# Altium project MB1829.PrjPcb (part 4 of 5)

## Sheet ST_LINK_V3E.SchDoc: ST_LINK_V3E
size A3; Date: Not used; ApprovedBy: Not used; CheckedBy: Not used; Author: Not used; CompanyName: STMicroelectronics; DrawnBy: Not used; Engineer: Not used; Organization: Not used; Address1: Not used; Address2: Not used; Address3: Not used; Address4: Not used; DocumentNumber: Not used; Revision: Not used; SheetNumber: 15; SheetTotal: 16; CurrentTime: Not used; CurrentDate: Not used; Time: Not used; DocumentFullPathAndName: Not used; DocumentName: Not used; ModifiedDate: Not used; ImagePath: Not used; ProjectName: Not used; Application_BuildNumber: Not used
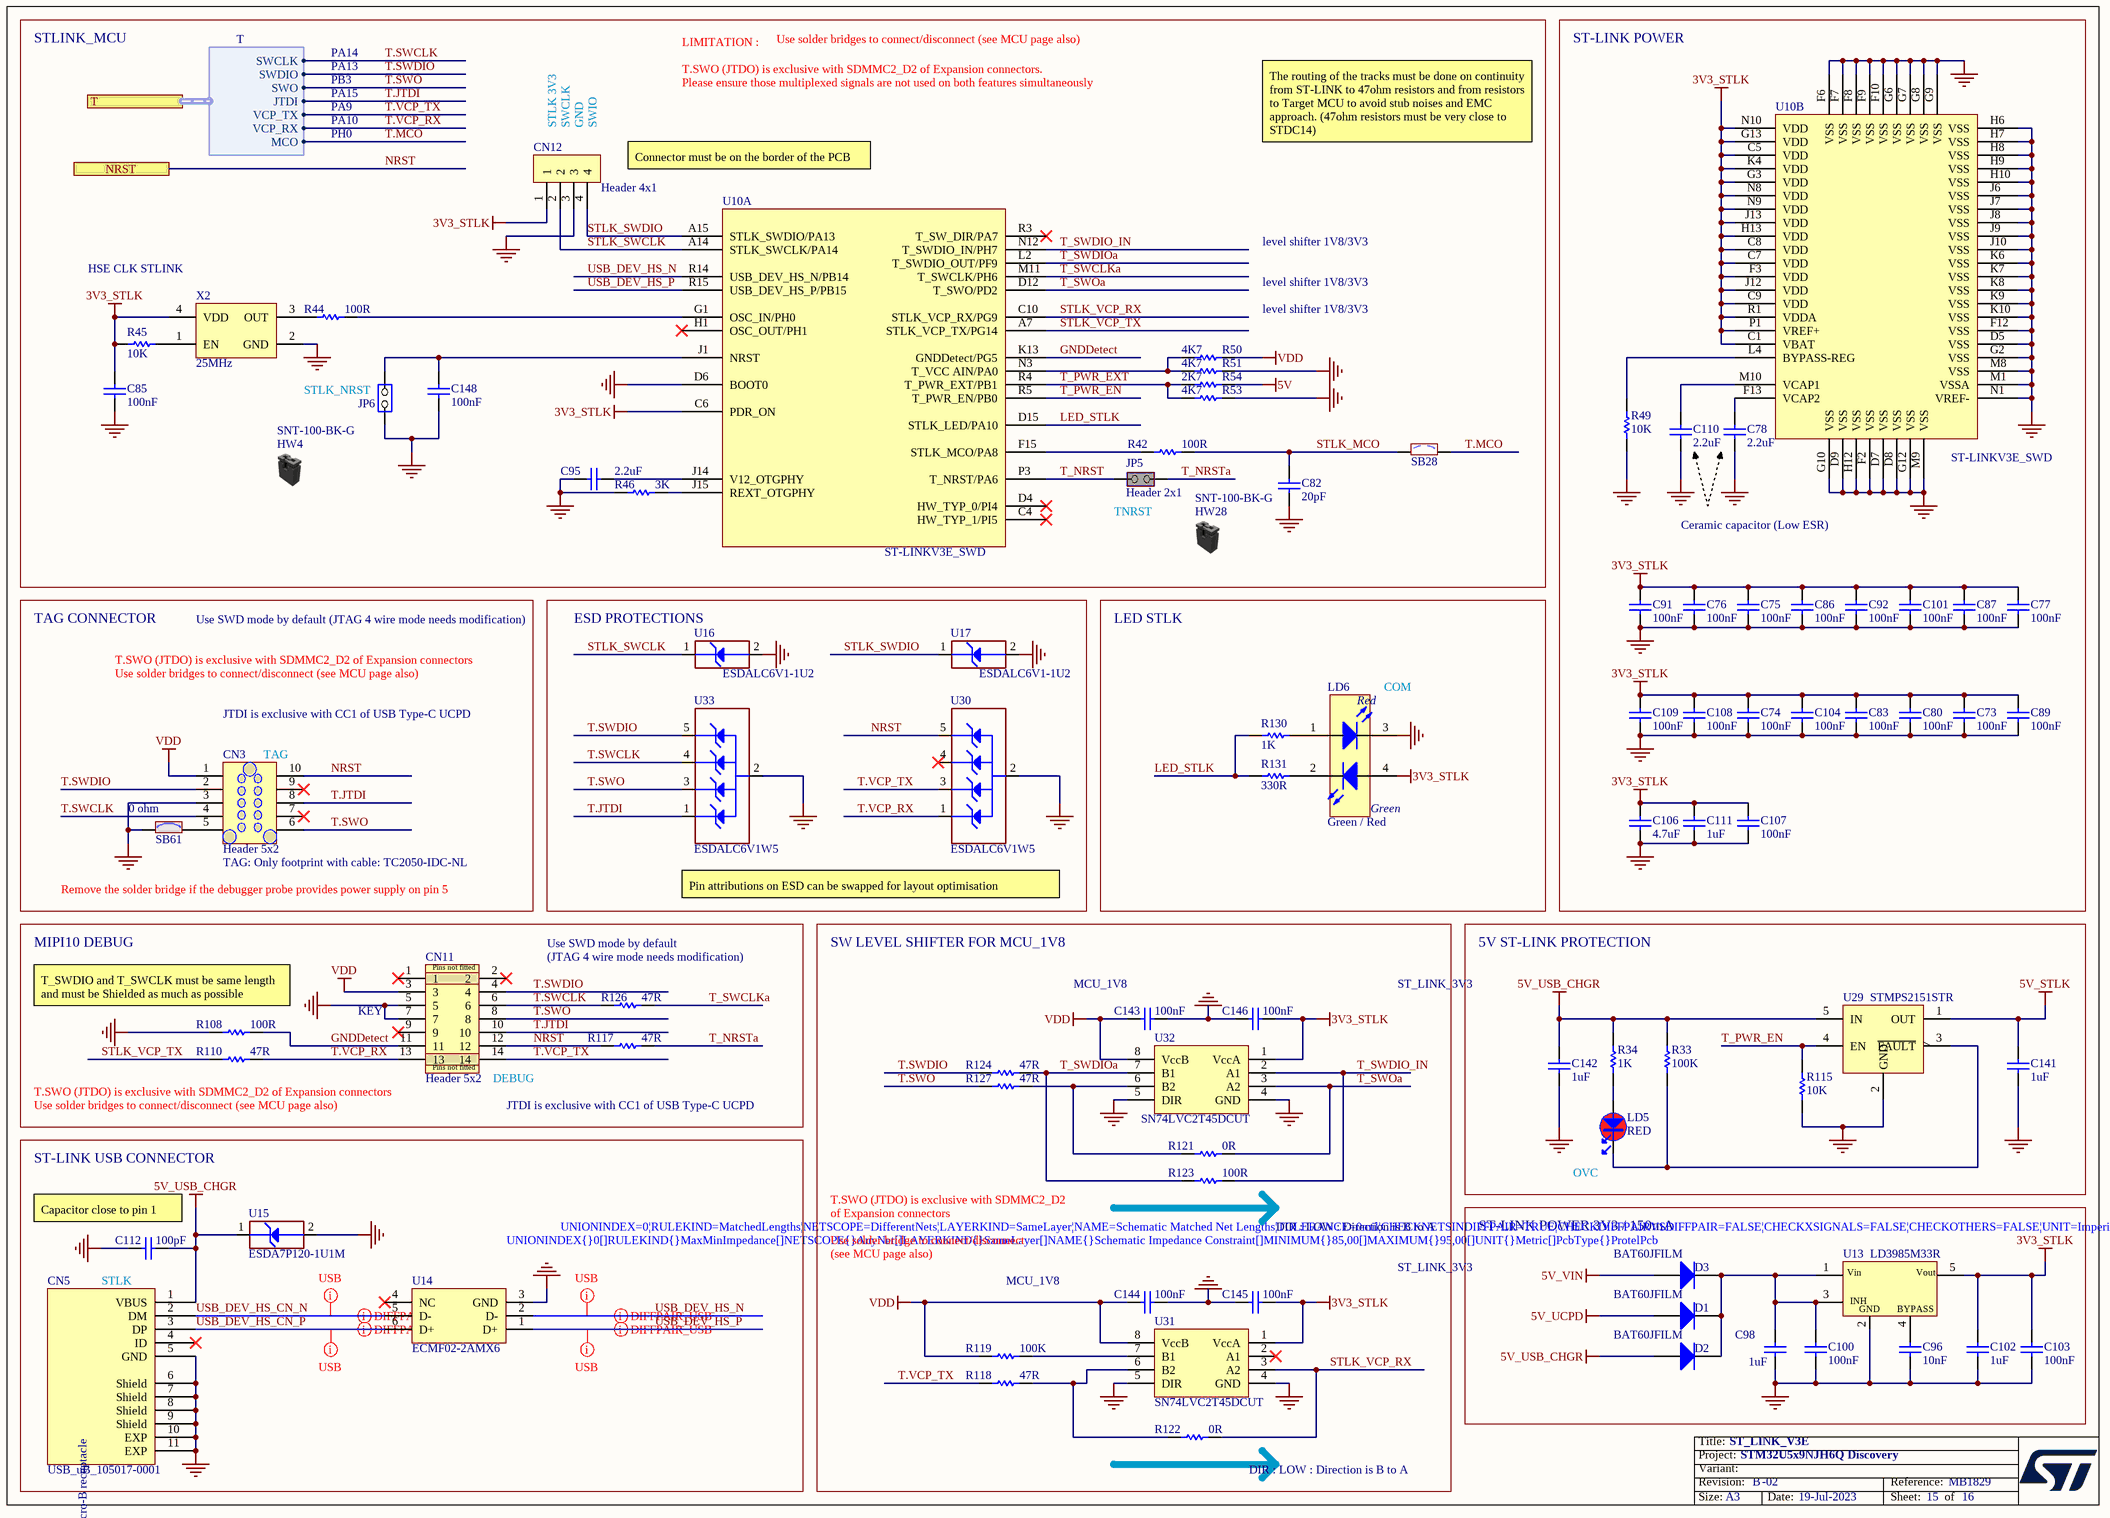
[diagram p10: ST_LINK_V3E.SchDoc]

### Parts
C73  value 100nF  [C0402]  (hidden comment: Capacitor)
C74  value 100nF  [C0402]  (hidden comment: Capacitor)
C75  value 100nF  [C0402]  (hidden comment: Capacitor)
C76  value 100nF  [C0402]  (hidden comment: Capacitor)
C77  value 100nF  [C0402]  (hidden comment: Capacitor)
C78  value 2.2uF  [C0603]  (hidden comment: Capacitor)
C80  value 100nF  [C0402]  (hidden comment: Capacitor)
C82  value 20pF  [C0402]  (hidden comment: Capacitor)
C83  value 100nF  [C0402]  (hidden comment: Capacitor)
C85  value 100nF  [C0402]  (hidden comment: Capacitor)
C86  value 100nF  [C0402]  (hidden comment: Capacitor)
C87  value 100nF  [C0402]  (hidden comment: Capacitor)
C89  value 100nF  [C0402]  (hidden comment: Capacitor)
C91  value 100nF  [C0402]  (hidden comment: Capacitor)
C92  value 100nF  [C0402]  (hidden comment: Capacitor)
C95  value 2.2uF  [C0603]  (hidden comment: Capacitor)
C96  value 10nF  [C0402]  (hidden comment: Capacitor)
C98  value 1uF  [C0402]  (hidden comment: Capacitor)
C100  value 100nF  [C0402]  (hidden comment: Capacitor)
C101  value 100nF  [C0402]  (hidden comment: Capacitor)
C102  value 1uF  [C0402]  (hidden comment: Capacitor)
C103  value 100nF  [C0402]  (hidden comment: Capacitor)
C104  value 100nF  [C0402]  (hidden comment: Capacitor)
C106  value 4.7uF  [C0603]  (hidden comment: Capacitor)
C107  value 100nF  [C0402]  (hidden comment: Capacitor)
C108  value 100nF  [C0402]  (hidden comment: Capacitor)
C109  value 100nF  [C0402]  (hidden comment: Capacitor)
C110  value 2.2uF  [C0603]  (hidden comment: Capacitor)
C111  value 1uF  [C0402]  (hidden comment: Capacitor)
C112  value 100pF  [C0402]  (hidden comment: Capacitor)
C141  value 1uF  [C0402]  (hidden comment: Capacitor)
C142  value 1uF  [C0402]  (hidden comment: Capacitor)
C143  value 100nF  [C0402]  (hidden comment: Capacitor)
C144  value 100nF  [C0402]  (hidden comment: Capacitor)
C145  value 100nF  [C0402]  (hidden comment: Capacitor)
C146  value 100nF  [C0402]  (hidden comment: Capacitor)
C148  value 100nF  [C0402]  (hidden comment: Capacitor)
CN3  value Header 5x2  [CON_TAG-C_TC2050-IDC-NL]  (hidden comment: Tag-10-C)
CN5  value USB_uB_105017-0001  [CON_USBMICROB_MOLEX_105017-0001_H2P90]  (hidden comment: USB_uB_105017.0001)
CN11  value Header 5x2  [CON_STDC14_Receiver_MEDIUM__3D_FTSH-105-01-L-DV-K]  (hidden comment: Header 7x2_MIPI10_on_STDC14)
CN12  Header 4x1  [CON_SAMTEC_TSW-104-07-G-S]
D1  BAT60JFILM  [DIO_SOD323]
D2  BAT60JFILM  [DIO_SOD323]
D3  BAT60JFILM  [DIO_SOD323]
HW4  value SNT-100-BK-G  (hidden comment: Shunt Black 2.54mm)  (mechanical)
HW28  value SNT-100-BK-G  (hidden comment: Shunt Black 2.54mm)  (mechanical)
JP5  value Header 2x1  [CON_SAMTEC_TSW-102-07-G-S]  (hidden comment: Jumper_Header 2x1 Fitted)
JP6  Jumper_Header 2x1  [CON_SAMTEC_TSW-102-07-G-S]  (value not drawn)
LD5  value RED  [LED_0603_OSRAM_LS-Q976-NR-1_RED_1A2K_H0P8]  (hidden comment: LED_red)
LD6  value Green / Red  [LED_BI-GR_WE-150141SV73110]  (hidden comment: LED_BICOLOR)
R33  value 100K  [R0402]  (hidden comment: Resistor)
R34  value 1K  [R0402]  (hidden comment: Resistor)
R42  value 100R  [R0402]  (hidden comment: Resistor)
R44  value 100R  [R0402]  (hidden comment: Resistor)
R45  value 10K  [R0402]  (hidden comment: Resistor)
R46  value 3K  [R0402]  (hidden comment: Resistor)
R49  value 10K  [R0402]  (hidden comment: Resistor)
R50  value 4K7  [R0402]  (hidden comment: Resistor)
R51  value 4K7  [R0402]  (hidden comment: Resistor)
R53  value 4K7  [R0402]  (hidden comment: Resistor)
R54  value 2K7  [R0402]  (hidden comment: Resistor)
R108  value 100R  [R0402]  (hidden comment: Resistor)
R110  value 47R  [R0402]  (hidden comment: Resistor)
R115  value 10K  [R0402]  (hidden comment: Resistor)
R117  value 47R  [R0402]  (hidden comment: Resistor)
R118  value 47R  [R0402]  (hidden comment: Resistor)
R119  value 100K  [R0402]  (hidden comment: Resistor)
R121  value 0R  [R0402]  (hidden comment: Resistor)
R122  value 0R  [R0402]  (hidden comment: Resistor)
R123  value 100R  [R0402]  (hidden comment: Resistor)
R124  value 47R  [R0402]  (hidden comment: Resistor)
R126  value 47R  [R0402]  (hidden comment: Resistor)
R127  value 47R  [R0402]  (hidden comment: Resistor)
R130  value 1K  [R0402]  (hidden comment: Resistor)
R131  value 330R  [R0402]  (hidden comment: Resistor)
SB28  SB_OFF  [SOLDER-BRIDGE_R0402-0R]  (value not drawn)
SB61  value 0 ohm  [SOLDER-BRIDGE_R0402-0R]  (hidden comment: SB_ON)
U10  ST-LINKV3E_SWD  [ICC_UFBGA201_176+25_10X10_P065]  (parts A,B of 2)
U13  LD3985M33R  [REG_SOT23-5L]
U14  ECMF02-2AMX6  [ESD_QFN-6L_1P7X1P5_P050]
U15  value ESDA7P120-1U1M  [ESD_QFN1610_2N_1K_2A]  (hidden comment: ESD-TRANSIL)
U16  value ESDALC6V1-1U2  [ESD_ST0201]  (hidden comment: ESD-TRANSIL)
U17  value ESDALC6V1-1U2  [ESD_ST0201]  (hidden comment: ESD-TRANSIL)
U29  STMPS2151STR  [MOS_SOT23-5L]
U30  ESDALC6V1W5  [ESD_SOT323-5L]
U31  SN74LVC2T45DCUT  [ICC_VSSOP8_DCU_R-PDSO-G8_2X2P30_P050]
U32  SN74LVC2T45DCUT  [ICC_VSSOP8_DCU_R-PDSO-G8_2X2P30_P050]
U33  ESDALC6V1W5  [ESD_SOT323-5L]
X2  value 25MHz  [OSC_NDK_NZ2520SB_4P]  (hidden comment: OSCILLATOR_4_PINS)

### Blocks framed on the sheet
STLINK_MCU: C82 C85 C95 C148 CN12 HW4 HW28 JP5 JP6 R42 R44-R46 R50 R51 R53 R54 SB28 U10 X2
ST-LINK POWER: C73-C78 C80 C83 C86 C87 C89 C91 C92 C101 C104 C106-C111 R49 U10
TAG CONNECTOR: CN3 SB61
ESD PROTECTIONS: U16 U17 U30 U33
LED STLK: LD6 R130 R131
MIPI10 DEBUG: CN11 R108 R110 R117 R126
SW LEVEL SHIFTER FOR MCU_1V8: C143-C146 R118 R119 R121-R124 R127 U31 U32
5V ST-LINK PROTECTION: C141 C142 LD5 R33 R34 R115 U29
ST-LINK USB CONNECTOR: C112 CN5 U14 U15
ST-LINK POWER 3V3 / 150mA: C96 C98 C100 C102 C103 D1-D3 U13

### Ports
NRST, T (harness T)

### Harnesses
T: SWCLK, SWDIO, SWO, JTDI, VCP_RX, VCP_TX, MCO

### Nets
3V3_STLK: C73.1 C74.1 C75.1 C76.1 C77.1 C80.1 C83.1 C85.1 C86.1 C87.1 C89.1 C91.1 C92.1 C101.1 C102.2 C103.2 C104.1 C106.2 C107.1 C108.1 C109.1 C111.2 C145.2 C146.2 CN12.1 LD6.4(Green_anode) R45.1 U10.C1(VBAT) U10.C5(VDD) U10.C6(PDR_ON) U10.C7(VDD) U10.C8(VDD) U10.C9(VDD) U10.F3(VDD) U10.G3(VDD) U10.G13(VDD) U10.H13(VDD) U10.J12(VDD) U10.J13(VDD) U10.K4(VDD) U10.N8(VDD) U10.N9(VDD) U10.N10(VDD) U10.P1(VREF+) U10.R1(VDDA) U13.5(Vout) U31.1(VccA) U32.1(VccA) X2.4(VDD)
5V: R54.1
5V_STLK: C141.2 U29.1(OUT)
5V_UCPD: D1.1(A)
5V_USB_CHGR: C112.2 C142.2 CN5.1(VBUS) D2.1(A) R33.2 R34.2 U15.1(IO1) U29.5(IN)
5V_VIN: D3.1(A)
GND: C73.2 C74.2 C75.2 C76.2 C77.2 C78.1 C80.2 C82.1 C83.2 C85.2 C86.2 C87.2 C89.2 C91.2 C92.2 C95.1 C96.1 C98.1 C100.1 C101.2 C102.1 C103.1 C104.2 C106.1 C107.2 C108.2 C109.2 C110.1 C111.1 C112.1 C141.1 C142.1 C143.2 C144.2 C145.1 C146.1 C148.2 CN3.3 CN5.5(GND) CN5.6(Shield) CN5.7(Shield) CN5.8(Shield) CN5.9(Shield) CN5.10(EXP) CN5.11(EXP) CN11.5 CN11.7 CN12.3 JP6.1(COMMON) LD6.3(RED_cathode) R46.1 R49.1 R51.2 R53.1 R108.1 R115.1 SB61.1 U10.D5(VSS) U10.D6(BOOT0) U10.D7(VSS) U10.D8(VSS) U10.D9(VSS) U10.F2(VSS) U10.F6(VSS) U10.F7(VSS) U10.F8(VSS) U10.F9(VSS) U10.F10(VSS) U10.F12(VSS) U10.G2(VSS) U10.G6(VSS) U10.G7(VSS) U10.G8(VSS) U10.G9(VSS) U10.G10(VSS) U10.G12(VSS) U10.H6(VSS) U10.H7(VSS) U10.H8(VSS) U10.H9(VSS) U10.H10(VSS) U10.H12(VSS) U10.J6(VSS) U10.J7(VSS) U10.J8(VSS) U10.J9(VSS) U10.J10(VSS) U10.K6(VSS) U10.K7(VSS) U10.K8(VSS) U10.K9(VSS) U10.K10(VSS) U10.M1(VSSA) U10.M8(VSS) U10.M9(VSS) U10.N1(VREF-) U13.2(GND) U14.3(GND) U15.2(GND) U16.2(GND) U17.2(GND) U29.2(GND) U30.2(GND) U31.4(GND) U31.5(DIR) U32.4(GND) U32.5(DIR) U33.2(GND) X2.2(GND)
VDD: C143.1 C144.1 CN3.1 CN11.3 R50.2 R119.1 U31.8(VccB) U32.8(VccB)
GNDDetect: CN11.11 R108.2 U10.K13(GNDDetect/PG5)
LED_STLK: R130.2 R131.2 U10.D15(STLK_LED/PA10)
NRST: CN3.10 CN11.12 R117.1 U30.5(IO4) ; port NRST
STLK_MCO: C82.2 R42.2 SB28.1
STLK_SWCLK: CN12.2 U10.A14(STLK_SWCLK/PA14) U16.1(IO1)
STLK_SWDIO: CN12.4 U10.A15(STLK_SWDIO/PA13) U17.1(IO1)
STLK_VCP_RX: R122.2 U10.C10(STLK_VCP_RX/PG9) U31.3(A2)
STLK_VCP_TX: R110.1 U10.A7(STLK_VCP_TX/PG14)
T.JTDI: CN3.8 CN11.10 U33.1(IO1) ; port T.JTDI
T.MCO: SB28.2 ; port T.MCO  [project net PH0-OSC_IN]
T.SWCLK: CN3.4 CN11.6 R126.1 U33.4(IO3) ; port T.SWCLK
T.SWDIO: CN3.2 CN11.4 R124.1 U33.5(IO4) ; port T.SWDIO
T.SWO: CN3.6 CN11.8 R127.1 U33.3(IO2) ; port T.SWO
T.VCP_RX: CN11.13 R110.2 U30.1(IO1) ; port T.VCP_RX
T.VCP_TX: CN11.14 R118.1 U30.3(IO2) ; port T.VCP_TX
T_NRST: JP5.1(COMMON) U10.P3(T_NRST/PA6)
T_NRSTa: JP5.2(NO) R117.2
T_PWR_EN: R115.2 U10.R5(T_PWR_EN/PB0) U29.4(EN)
T_PWR_EXT: R53.2 R54.2 U10.R4(T_PWR_EXT/PB1)
T_SWCLKa: R126.2 U10.M11(T_SWCLK/PH6)
T_SWDIO_IN: R123.2 U10.N12(T_SWDIO_IN/PH7) U32.2(A1)
T_SWDIOa: R123.1 R124.2 U10.L2(T_SWDIO_OUT/PF9) U32.7(B1)
T_SWOa: R121.2 U10.D12(T_SWO/PD2) U32.3(A2)
USB_DEV_HS_CN_N: CN5.2(DM) U14.5(D-)
USB_DEV_HS_CN_P: CN5.3(DP) U14.6(D+)
USB_DEV_HS_N: U10.R14(USB_DEV_HS_N/PB14) U14.2(D-)
USB_DEV_HS_P: U10.R15(USB_DEV_HS_P/PB15) U14.1(D+)
NetC78_2: C78.2 U10.F13(VCAP2)
NetC95_2: C95.2 U10.J14(V12_OTGPHY)
NetC96_2: C96.2 U13.4(BYPASS)
NetC98_2: C98.2 C100.2 D1.2(K) D2.2(K) D3.2(K) U13.1(Vin) U13.3(CE)
NetC110_2: C110.2 U10.M10(VCAP1)
NetC148_1: C148.1 JP6.2(NO) U10.J1(NRST)
NetCN3_5: CN3.5 SB61.2
NetLD5_1: LD5.1 R34.1
NetLD5_2: LD5.2 R33.1 U29.3(~{FAULT})
NetLD6_1: LD6.1(Red_anode) R130.1
NetLD6_2: LD6.2(Green_cathode) R131.1
NetR42_1: R42.1 U10.F15(STLK_MCO/PA8)
NetR44_1: R44.1 X2.3(OUT)
NetR44_2: R44.2 U10.G1(OSC_IN/PH0)
NetR45_2: R45.2 X2.1(EN)
NetR46_2: R46.2 U10.J15(REXT_OTGPHY)
NetR49_2: R49.2 U10.L4(BYPASS-REG)
NetR50_1: R50.1 R51.1 U10.N3(T_VCC_AIN/PA0)
NetR118_2: R118.2 R122.1 U31.6(B2)
NetR119_2: R119.2 U31.7(B1)
NetR121_1: R121.1 R127.2 U32.6(B2)

Not connected (* = marked no-connect by the designer): CN3 7* 9*; CN5 4(ID)*; CN11 1* 2* 9*; U10 C4(HW_TYP_1/PI5)* D4(HW_TYP_0/PI4)* H1(OSC_OUT/PH1)* R3(T_SW_DIR/PA7)*; U14 4(NC)*; U30 4(IO3)*; U31 2(A1)*

### Layout directives
differential pair; rule Impedance Constraint [Min = 85.00    Max = 95.00    ]: USB_DEV_HS_CN_N, USB_DEV_HS_CN_P, USB_DEV_HS_N, USB_DEV_HS_P
rule Undefined; rule Matched Net Lengths [Tolerance = 0mil]; rule Impedance Constraint [Min = 85.00    Max = 95.00    ]: USB_DEV_HS_CN_N, USB_DEV_HS_CN_P, USB_DEV_HS_N, USB_DEV_HS_P

### Notes on the sheet
- Use solder bridges to connect/disconnect (see MCU page also)
- PA14
- PA13
- PB3
- PA15
- PA9
- LIMITATION :
  T.SWO (JTDO) is exclusive with SDMMC2_D2 of Expansion connectors.
  Please ensure those multiplexed signals are not used on both features simultaneously
- PA10
- PH0
- STLK 3V3
- SWCLK
- GND
- SWIO
- Connector must be on the border of the PCB
- The routing of the tracks must be done on continuity from ST-LINK to 47ohm resistors and from resistors to Target MCU to avoid stub noises and EMC approach. (47ohm resistors must be very close to STDC14)
- level shifter 1V8/3V3
- HSE CLK STLINK
- (near JP6) STLK_NRST
- (near JP5) TNRST
- Ceramic capacitor (Low ESR)
- Use SWD mode by default (JTAG 4 wire mode needs modification)
- T.SWO (JTDO) is exclusive with SDMMC2_D2 of Expansion connectors
- JTDI is exclusive with CC1 of USB Type-C UCPD
- (near LD6) COM
- (near CN3) TAG
- Remove the solder bridge if the debugger probe provides power supply on pin 5
- (near CN3) TAG: Only footprint with cable: TC2050-IDC-NL
- Pin attributions on ESD can be swapped for layout optimisation
- Use SWD mode by default
- (near R126) (JTAG 4 wire mode needs modification)
- MCU_1V8
- ST_LINK_3V3
- (near R108) T_SWDIO and T_SWCLK must be same length and must be Shielded as much as possible
- (near CN11) KEY
- (near CN11) DEBUG
- (near LD5) OVC
- (near C112) Capacitor close to pin 1
- T.SWO (JTDO) is exclusive with SDMMC2_D2
- of Expansion connectors
- Use solder bridge to connect/disconnect
- (see MCU page also)
- (near R123) DIR : LOW : Direction is B to A
- STLK
- (near R122) DIR : LOW : Direction is B to A
- Title:
- Project:
- Size:
- Revision:
- Variant:
- A3
- -
- Date:
- Reference:
- Sheet:
- of
- (in symbol MCD-00028) USB_Micro-B receptacle
- (in symbol MCD-00086) INH
- (in symbol MCD-02021) Pins not fitted
- (in symbol MCD-02631) Red; Green

### Library data of the parts
C73-C77 C80 C83 C85-C87 C89 C91 C92 C100 C101 C103 C104 C107-C109 C143-C146 C148 = MCD-00006: as C36-C40 on sheet MCU_PWR; Internal_Part_Number: MCD-00006; Status: Released; Part_Type: Capacitor; Package: 0402; ComponentLink1URL: http://tunmcdsvn.tun.st.com/Component_Documentation_Library/Trunk/Capacitor/YAGEO_X7R_Series; Order_Code_Digikey: 311-1338-1-ND; Order_Code_Farnell: 9402047
C78 C95 C110 = MCD-00012: Capacitor, MLCC, 2.2uF, 10V, X5R, +/- 10%, 0603, T=0.8mm; Manufacturer_Part_Number: CC0603KRX5R6BB225; Manufacturer: YAGEO; BMS_Part_Number: 9142010; Part_Preference: Recommended; Component_Country_Of_Origin: China; Internal_Part_Number: MCD-00012; Status: Released; Part_Type: Capacitor; Package: 0603; ComponentLink1URL: http://tunmcdsvn.tun.st.com/Component_Documentation_Library/Trunk/Capacitor/YAGEO_X5R_Series; Order_Code_Digikey: 311-1451-1-ND; Order_Code_Farnell: 2370679; Order_Code_RS: N/A
C82 = MCD-00016: Capacitor, MLCC, 20pF, 50V, NPO, +/- 5%, 0402, T=0.5mm; Manufacturer_Part_Number: CC0402JRNPO9BN200; Manufacturer: YAGEO; Part_Preference: Recommended; Component_Country_Of_Origin: China; Internal_Part_Number: MCD-00016; Status: Released; Package: 0402; Part_Type: Capacitor; ComponentLink1URL: http://tunmcdsvn.tun.st.com/Component_Documentation_Library/Trunk/Capacitor/YAGEO_NP0_Series; Order_Code_Digikey: 311-1417-1-ND; Order_Code_Farnell: N/A; Order_Code_RS: N/A
C96 = MCD-00011: Capacitor, MLCC, 10nF, 16V, X7R, +/-10%, 0402, T=0.5mm; Manufacturer_Part_Number: CC0402KRX7R7BB103; Manufacturer: YAGEO; Part_Preference: Recommended; Order_Code_RS: 669-8688; Component_Country_Of_Origin: China; Internal_Part_Number: MCD-00011; Status: Released; Part_Type: Capacitor; Package: 0402; ComponentLink1URL: http://tunmcdsvn.tun.st.com/Component_Documentation_Library/Trunk/Capacitor/YAGEO_X7R_Series; Order_Code_Digikey: 311-1042-1-ND; Order_Code_Farnell: 3019275
C98 C102 C111 C141 C142 = MCD-02609: Capacitor, MLCC, 1uF, 25V, X5R, +/-10%, 0402, T=0.5mm; Part_Preference: Recommended; Manufacturer: YAGEO; Manufacturer_Part_Number: CC0402KRX5R8BB105; Internal_Part_Number: MCD-02609; Status: New; Part_Type: Capacitor; Package: 0402; ComponentLink1URL: http://tunmcdsvn.tun.st.com/Component_Documentation_Library/Trunk/Capacitor/YAGEO_X5R_Series; Order_Code_Digikey: 311-1698-2-ND; Order_Code_Farnell: 3366440; Order_Code_RS: N/A
C106 = MCD-00009: Capacitor, MLCC, 4.7uF, 16V, X5R, +/-10%, 0603, T=0.8mm; Manufacturer_Part_Number: CC0603KRX5R7BB475; Manufacturer: YAGEO; Part_Preference: Recommended; Component_Country_Of_Origin: China; Internal_Part_Number: MCD-00009; Status: Released; Part_Type: Capacitor; Package: 0603; ComponentLink1URL: http://tunmcdsvn.tun.st.com/Component_Documentation_Library/Trunk/Capacitor/YAGEO_X5R_Series; Order_Code_Digikey: 311-1785-1-ND; Order_Code_Farnell: N/A; Order_Code_RS: N/A
C112 = MCD-00205: Capacitor, MLCC, 100pF, 50V, NPO, +/-5%, 0402, T=0.5mm; Manufacturer_Part_Number: CC0402JRNPO9BN101; Manufacturer: YAGEO; Part_Preference: Recommended; Component_Country_Of_Origin: China; Internal_Part_Number: MCD-00205; Status: Released; Part_Type: Capacitor; Package: 0402; ComponentLink1URL: http://tunmcdsvn.tun.st.com/Component_Documentation_Library/Trunk/Capacitor/YAGEO_NP0_Series; Order_Code_Digikey: 311-1024-1-ND; Order_Code_Farnell: 3019226RL; Order_Code_RS: N/A
CN3 = MCD-00031: Header_Plug-of-nails, 5x2, 1.27mm, No legs; Part_Type: Connector; Manufacturer_Part_Number: TC2050-IDC-NL-FP; Manufacturer: TAG-CONNECTLLC; Part_Preference: Recommended; Internal_Part_Number: MCD-00031; Status: Released; ComponentLink1URL: http://tunmcdsvn.tun.st.com/Component_Documentation_Library/Trunk/Connector/TAG-CONNECT_LLC_TC2050-IDC-NL-FP/; Order_Code_Digikey: N/A; Order_Code_Farnell: N/A; Order_Code_RS: N/A
CN5 = MCD-00028: MicroUSB_TypeB, 5pins, 0.65mm, RA, SMD, T=2.9mm; Manufacturer_Part_Number: 1050170001; Manufacturer: MOLEX; Part_Type: Connector; Part_Preference: Recommended; Order_Code_RS: 848-6764; Component_Country_Of_Origin: Unknown; Internal_Part_Number: MCD-00028; Status: Released; ComponentLink1URL: http://tunmcdsvn.tun.st.com/Component_Documentation_Library/Trunk/Connector/MOLEX_1050170001/; Order_Code_Digikey: WM1399TR-ND; Order_Code_Farnell: 2293836
CN11 = MCD-02021: Header_MIPI10, 5x2, 1.27mm, VR, SMD, T=6.1mm; Part_Type: Connector; Manufacturer: SAMTEC; Manufacturer_Part_Number: FTSH-105-01-L-DV-K-P-TR; Part_Preference: Recommended; Component_Country_Of_Origin: China, Costa Rica, Malaysia, United States, Vietnam; Internal_Part_Number: MCD-02021; Status: Checked; ComponentLink1URL: http://tunmcdsvn.tun.st.com/Component_Documentation_Library/Trunk/Connector/SAMTEC_FTSH_Series/; Order_Code_Digikey: N/A; Order_Code_Farnell: N/A; Order_Code_RS: N/A
CN12 = MCD-00029: Header, 4x1, 2.54mm, VR, TH, T=5.84mm/2.54mm; Manufacturer_Part_Number: TSW-104-07-G-S; Manufacturer: SAMTEC; Part_Type: Connector; Part_Preference: Recommended; Order_Code_RS: 161-2261; Component_Country_Of_Origin: China, Costa Rica, Malaysia, United States, Vietnam; Internal_Part_Number: MCD-00029; Value: Header 4x1; Status: Released; ComponentLink1URL: http://tunmcdsvn.tun.st.com/Component_Documentation_Library/Trunk/Connector/SAMTEC_TSW_Series/; Order_Code_Digikey: TSW-104-07-G-S-ND; Order_Code_Farnell: 2667450
D1-D3 = MCD-00034: Manufacturer: STMICROELECTRONICS; Part_Type: Diode; BMS_Part_Number: 9151097; Part_Preference: Recommended; Manufacturer_HQ_COO: EU; Component_Country_Of_Origin: China; Internal_Part_Number: MCD-00034; Value: BAT60JFILM; Manufacturer_Part_Number: BAT60JFILM; Status: Released; ComponentLink1URL: http://tunmcdsvn.tun.st.com/Component_Datasheet_Library/Trunk/Diodes/STM_Diode_BAT60JFILM-SOD323
HW4 HW28 = MCD-00043: SHUNT 2.54mm BLACK; Manufacturer: SAMTEC; Part_Type: Misc; Part_Preference: Recommended; Component_Country_Of_Origin: China, Costa Rica, Malaysia, United States, Vietnam; Internal_Part_Number: MCD-00043; Manufacturer_Part_Number: SNT-100-BK-G; Status: Released; ComponentLink1URL: http://tunmcdsvn.tun.st.com/Component_Datasheet_Library/Trunk/Connectors/Samtec_Shunt_Jumper_SNT100
JP5 = MCD-01904: Header, 2x1, 2.54mm, VR, TH, T=5.84mm/2.54mm; Part_Preference: Recommended; Part_Type: Connector; Manufacturer: SAMTEC; Manufacturer_Part_Number: TSW-102-07-G-S; Order_Code_RS: 155-7981; Component_Country_Of_Origin: China, Costa Rica, Malaysia, United States, Vietnam; Internal_Part_Number: MCD-01904; Status: Checked; ComponentLink1URL: http://tunmcdsvn.tun.st.com/Component_Documentation_Library/Trunk/Connector/SAMTEC_TSW_Series/; Order_Code_Digikey: SAM1029-02-ND; Order_Code_Farnell: 2505044
JP6 = MCD-00045: Header, 2x1, 2.54mm, VR, TH, T=5.84mm/2.54mm; Part_Type: Connector; Manufacturer_Part_Number: TSW-102-07-G-S; Manufacturer: SAMTEC; Part_Preference: Recommended; Order_Code_RS: 155-5312; Component_Country_Of_Origin: China, Costa Rica, Malaysia, United States, Vietnam; Internal_Part_Number: MCD-00045; Value: Header 2x1; Status: Released; ComponentLink1URL: http://tunmcdsvn.tun.st.com/Component_Documentation_Library/Trunk/Connector/SAMTEC_TSW_Series/; Order_Code_Digikey: SAM1029-02-ND; Order_Code_Farnell: 2505044
LD5 = MCD-00586: LED Red, 0603 SMD, Forward Voltage Typ=2V, Max=2.5V; Manufacturer_Part_Number: LS Q976-NR-1; Manufacturer: OSRAM OPTO SEMICONDUCTORS; Part_Type: Display; Part_Preference: Recommended; Component_Country_Of_Origin: Unknown; ShowFields: YES; ID: 3158; Internal_Part_Number: MCD-00586; Status: Released; ComponentLink1URL: http://tunmcdsvn.tun.st.com/Component_Datasheet_Library/Trunk/Display/OSRAM_LED_RED_LS Q976-NR-1; Package: LED 0603; Order_Code_Digikey: 475-2512-1-ND
LD6 = MCD-02631: LED Bicolor, Green/Red, 2V, 20mA,  4-PLCC; Part_Type: Display; Part_Preference: Recommended; Manufacturer: WURTH ELEKTRONIK; Manufacturer_Part_Number: 150141SV73110; Order_Code_RS: 184-6963; Component_Country_Of_Origin: China; ShowFields: YES; ID: 4737; Internal_Part_Number: MCD-02631; Status: Checked; Package: 4-PLCC; ComponentLink1URL: http://tunmcdsvn.tun.st.com/Component_Documentation_Library/Trunk/Display/WURTH_ELEKTRONIK_150141SV73110; Order_Code_Digikey: 732-13404-2-ND; Order_Code_Farnell: 2990869
R33 R119 = MCD-00059: Resistor, 100K, 0402, +/-1%, 1/16W; Manufacturer_Part_Number: RC0402FR-07100KL; Manufacturer: YAGEO; Part_Preference: Recommended; Component_Country_Of_Origin: China; Internal_Part_Number: MCD-00059; Status: Released; Part_Type: Resistor; Package: 0402; ComponentLink1URL: http://tunmcdsvn.tun.st.com/Component_Documentation_Library/Trunk/Resistor/YAGEO_RC_L_Series; Order_Code_Digikey: 311-100KLRTR-ND; Order_Code_Farnell: 2421891; Order_Code_RS: N/A
R34 R130 = MCD-00061: Resistor, 1K, 0402, +/-1%,1/16W; Manufacturer_Part_Number: RC0402FR-071KL; Manufacturer: YAGEO; Part_Preference: Recommended; Component_Country_Of_Origin: China; ShowFields: YES; ID: 2532; Internal_Part_Number: MCD-00061; Status: Released; Part_Type: Resistor; Package: 0402; ComponentLink1URL: http://tunmcdsvn.tun.st.com/Component_Documentation_Library/Trunk/Resistor/YAGEO_RC_L_Series; Order_Code_Digikey: 311-1.00KLRCT-ND; Order_Code_Farnell: 9239235; Order_Code_RS: N/A
R42 R44 R108 R123 = MCD-00067: Resistor, 100R, 0402, +/- 1%, 1/16W; Manufacturer_Part_Number: RC0402FR-07100RL; Manufacturer: YAGEO; Part_Preference: Recommended; Component_Country_Of_Origin: China; Internal_Part_Number: MCD-00067; Status: Released; Part_Type: Resistor; Package: 0402; ComponentLink1URL: http://tunmcdsvn.tun.st.com/Component_Documentation_Library/Trunk/Resistor/YAGEO_RC_L_Series; Order_Code_Digikey: 311-100LRCT-ND; Order_Code_Farnell: 9239111; Order_Code_RS: N/A
R45 R49 R115 = MCD-00053: Resistor, 10K, 0402, +/-1%, 1/16W; Manufacturer_Part_Number: RC0402FR-0710KL; Manufacturer: YAGEO; BMS_Part_Number: 9131590; Part_Preference: Recommended; Component_Country_Of_Origin: China; Internal_Part_Number: MCD-00053; Status: Released; Part_Type: Resistor; Package: 0402; ComponentLink1URL: http://tunmcdsvn.tun.st.com/Component_Documentation_Library/Trunk/Resistor/YAGEO_RC_L_Series; Order_Code_Digikey: 311-10.0KLRCT-ND; Order_Code_Farnell: 9239359; Order_Code_RS: N/A
R46 = MCD-00185: Resistor, 3K, 0402, +/-1%, 1/16W; Manufacturer_Part_Number: RC0402FR-073KL; Manufacturer: YAGEO; Part_Preference: Recommended; Component_Country_Of_Origin: China; Internal_Part_Number: MCD-00185; Status: Released; Part_Type: Resistor; Package: 0402; ComponentLink1URL: http://tunmcdsvn.tun.st.com/Component_Documentation_Library/Trunk/Resistor/YAGEO_RC_L_Series; Order_Code_Digikey: 311-3KLRCT-ND; Order_Code_Farnell: 1458777; Order_Code_RS: N/A
R50 R51 R53 = MCD-00065: Resistor, 4K7, 0402, +/-1%, 1/16W; Manufacturer_Part_Number: RC0402FR-074K7L; Manufacturer: YAGEO; Part_Preference: Recommended; Component_Country_Of_Origin: China; Internal_Part_Number: MCD-00065; Status: Released; Part_Type: Resistor; Package: 0402; ComponentLink1URL: http://tunmcdsvn.tun.st.com/Component_Documentation_Library/Trunk/Resistor/YAGEO_RC_L_Series; Order_Code_Digikey: 311-4.7KLRCT-ND; Order_Code_Farnell: 9239316; Order_Code_RS: N/A
R54 = MCD-00055: Resistor, 2K7, 0402, +/-1%, 1/16W; Manufacturer_Part_Number: RC0402FR-072K7L; Manufacturer: YAGEO; Part_Preference: Recommended; Component_Country_Of_Origin: China; Internal_Part_Number: MCD-00055; Status: Released; Part_Type: Resistor; Package: 0402; ComponentLink1URL: http://tunmcdsvn.tun.st.com/Component_Documentation_Library/Trunk/Resistor/YAGEO_RC_L_Series; Order_Code_Digikey: 311-2.70KLRCT-ND; Order_Code_Farnell: 9239286; Order_Code_RS: N/A
R110 R117 R118 R124 R126 R127 = MCD-00481: Resistor, 47R, 0402, +/-1%, 1/16W; Manufacturer_Part_Number: RC0402FR-0747RL; Manufacturer: YAGEO; Part_Preference: Recommended; Component_Country_Of_Origin: China; Internal_Part_Number: MCD-00481; Status: Released; Part_Type: Resistor; Package: 0402; ComponentLink1URL: http://tunmcdsvn.tun.st.com/Component_Documentation_Library/Trunk/Resistor/YAGEO_RC_L_Series; Order_Code_Digikey: 311-47.0LRCT-ND; Order_Code_Farnell: 9239073; Order_Code_RS: N/A
R121 R122 = MCD-00052: as R22-R24 on sheet OCTOSPI_FLASH; Internal_Part_Number: MCD-00052; Status: Released; Part_Type: Resistor; Package: 0402; ComponentLink1URL: http://tunmcdsvn.tun.st.com/Component_Documentation_Library/Trunk/Resistor/YAGEO_RC_L_Series; Order_Code_Digikey: 311-0.0JRCT-ND; Order_Code_Farnell: 9232516RL
R131 = MCD-00062: Resistor, 330R, 0402, +/-1%, 1/16W; Manufacturer_Part_Number: RC0402FR-07330RL; Manufacturer: YAGEO; Part_Preference: Recommended; Component_Country_Of_Origin: China; Internal_Part_Number: MCD-00062; Status: Released; Part_Type: Resistor; Package: 0402; ComponentLink1URL: http://tunmcdsvn.tun.st.com/Component_Documentation_Library/Trunk/Resistor/YAGEO_RC_L_Series; Order_Code_Digikey: 311-330LRCT-ND; Order_Code_Farnell: 9239170; Order_Code_RS: N/A
SB28 = MCD-02162: Solder Bridge 0402 OFF; Part_Type: Misc; Manufacturer_Part_Number: RC0402JR-070RL; Manufacturer: YAGEO; Part_Preference: Recommended; Order_Code_RS: 618-5804; Component_Country_Of_Origin: China; Internal_Part_Number: MCD-02162; Status: Checked; Package: SB0402; ComponentLink1URL: http://tunmcdsvn.tun.st.com/Component_Datasheet_Library/Trunk/Resistors/Yageo_Resistor_RC0402-series; Order_Code_Digikey: 311-0.0JRTR-ND; Order_Code_Farnell: 2363467
SB61 = MCD-01618: Solder Bridge 0402 ON; Part_Type: Misc; Part_Preference: Recommended; Manufacturer: YAGEO; Manufacturer_Part_Number: RC0402JR-070RL; Order_Code_RS: 618-5804; Component_Country_Of_Origin: China; ShowFields: YES; ID: 3718; Internal_Part_Number: MCD-01618; Status: Released; Package: SB0402; ComponentLink1URL: http://tunmcdsvn.tun.st.com/Component_Documentation_Library/Trunk/Resistor/YAGEO_RC0402_Series; Order_Code_Digikey: 311-0.0JRTR-ND; Order_Code_Farnell: 2363467
U10 = MCD-00596: STM32F723IEK  (STM32F7) BGA176; Part_Type: IC; Manufacturer_Part_Number: STM32F723IEK6; Manufacturer: STMICROELECTRONICS; BMS_Part_Number: 9175300; Part_Preference: Recommended; Manufacturer_HQ_COO: EU; Component_Country_Of_Origin: Philippines; Internal_Part_Number: MCD-00596; Value: ST-LINKV3E_SWD; Status: Released; ComponentLink1URL: http://tunmcdsvn.tun.st.com/Component_Datasheet_Library/Trunk/IC/BGA176+25L_10x10x0.6_pitch0.65
U13 = MCD-00086: Ultra low drop-low noise BiCMOS voltage, regulators low ESR capacitors compatible; Manufacturer: STMICROELECTRONICS; Part_Type: IC; BMS_Part_Number: 9176161; Part_Preference: Recommended; Manufacturer_HQ_COO: EU; Component_Country_Of_Origin: China; Internal_Part_Number: MCD-00086; Value: LD3985M33R; Status: Released; Manufacturer_Part_Number: LD3985M33R; ComponentLink1URL: http://tunmcdsvn.tun.st.com/Component_Datasheet_Library/Trunk/IC/STM_LDO_LD3985
U14 = MCD-00649: Common mode filter with ESD protection for USB 2.0 interface; Part_Type: Diode; Manufacturer: STMICROELECTRONICS; BMS_Part_Number: 9151138; Part_Preference: Recommended; Manufacturer_HQ_COO: EU; Component_Country_Of_Origin: China; Internal_Part_Number: MCD-00649; Value: ECMF02-2AMX6; Status: Released; Manufacturer_Part_Number: ECMF02-2AMX6; ComponentLink1URL: http://tunmcdsvn.tun.st.com/Component_Datasheet_Library/Trunk/Diodes/STM_ESD_ECMF02-2AMX6
U15 = MCD-01026: High power transient voltage suppressor; Part_Type: Diode; Manufacturer: STMICROELECTRONICS; BMS_Part_Number: 9179046; Part_Preference: Recommended; Manufacturer_HQ_COO: EU; Component_Country_Of_Origin: China; Internal_Part_Number: MCD-01026; Status: Released; Manufacturer_Part_Number: ESDA7P120-1U1M; Package: QFN1610; ComponentLink1URL: http://tunmcdsvn.tun.st.com/Component_Datasheet_Library/Trunk/Diodes/STM_ESD_ESDA7P120-1U1M
U16 U17 = MCD-00170: ESD protection 6V1; Part_Type: Diode; Manufacturer: STMICROELECTRONICS; BMS_Part_Number: 9151132; Part_Preference: Recommended; Manufacturer_HQ_COO: EU; Component_Country_Of_Origin: China; Internal_Part_Number: MCD-00170; Status: Released; Manufacturer_Part_Number: ESDALC6V1-1U2; ComponentLink1URL: http://tunmcdsvn.tun.st.com/Component_Datasheet_Library/Trunk/Diodes/STM_ESD_ESDALC6V1-1U2
U29 = MCD-00159: 500mA, Enhanced single channel power switches with active high enable pin; Part_Type: IC; Manufacturer: STMICROELECTRONICS; BMS_Part_Number: 9159009; Part_Preference: Recommended; Manufacturer_HQ_COO: EU; Component_Country_Of_Origin: Malaysia; Internal_Part_Number: MCD-00159; Value: STMPS2151STR; Status: Released; Manufacturer_Part_Number: STMPS2151STR; ComponentLink1URL: http://tunmcdsvn.tun.st.com/Component_Datasheet_Library/Trunk/IC/STM_PWR-Switch_STMPS2151STR
U30 U33 = MCD-00136: Dual Transil array for ESD protection; Part_Type: Diode; Manufacturer: STMICROELECTRONICS; BMS_Part_Number: 9151112; Part_Preference: Recommended; Manufacturer_HQ_COO: EU; Component_Country_Of_Origin: China; Internal_Part_Number: MCD-00136; Value: ESDALC6V1W5; Status: Released; Manufacturer_Part_Number: ESDALC6V1W5; ComponentLink1URL: http://tunmcdsvn.tun.st.com/Component_Datasheet_Library/Trunk/Diodes/STM_ESD_ESDALC6V1W5
U31 U32 = MCD-00264: Dual bit dual supply bus transceiver; Part_Type: IC; Manufacturer: TEXAS INSTRUMENTS; BMS_Part_Number: 9169311; Part_Preference: Recommended; Component_Country_Of_Origin: Thailand; Internal_Part_Number: MCD-00264; Value: SN74LVC2T45DCUT; Status: Released; Manufacturer_Part_Number: SN74LVC2T45DCUT; ComponentLink1URL: http://tunmcdsvn.tun.st.com/Component_Datasheet_Library/Trunk/IC/TI_Dual_bit_tranceiver_SN74LVC2T45
X2 = MCD-00597: Oscillator, SPXO, 25Mhz, +/-50ppm, 3V3, square wave, 2.5x2mm; Part_Type: Crystal_Osc; Manufacturer_Part_Number: NZ2520SH-25MHZ-END4869C; Manufacturer: NDK; BMS_Part_Number: 9157050; Part_Preference: Recommended; Component_Country_Of_Origin: Unknown; Internal_Part_Number: MCD-00597; Status: Released; ComponentLink1URL: http://tunmcdsvn.tun.st.com/Component_Documentation_Library/Trunk/Crytal_Oscillator/NDK_NZ2520SH_Series; Package: 2.5x2mm; Order_Code_Digikey: N/A; Order_Code_Farnell: N/A; Order_Code_RS: N/A

## Sheet USBHS_TYPEC.SchDoc: USB HS Type-C
size A4; Date: Not used; ApprovedBy: Not used; CheckedBy: Not used; Author: Not used; CompanyName: STMicroelectronics; DrawnBy: Not used; Engineer: Not used; Organization: Not used; Address1: Not used; Address2: Not used; Address3: Not used; Address4: Not used; DocumentNumber: Not used; Revision: Not used; SheetNumber: 9; SheetTotal: 16; CurrentTime: Not used; CurrentDate: Not used; Time: Not used; DocumentFullPathAndName: Not used; DocumentName: Not used; ModifiedDate: Not used; ImagePath: Not used; ProjectName: Not used; Application_BuildNumber: Not used
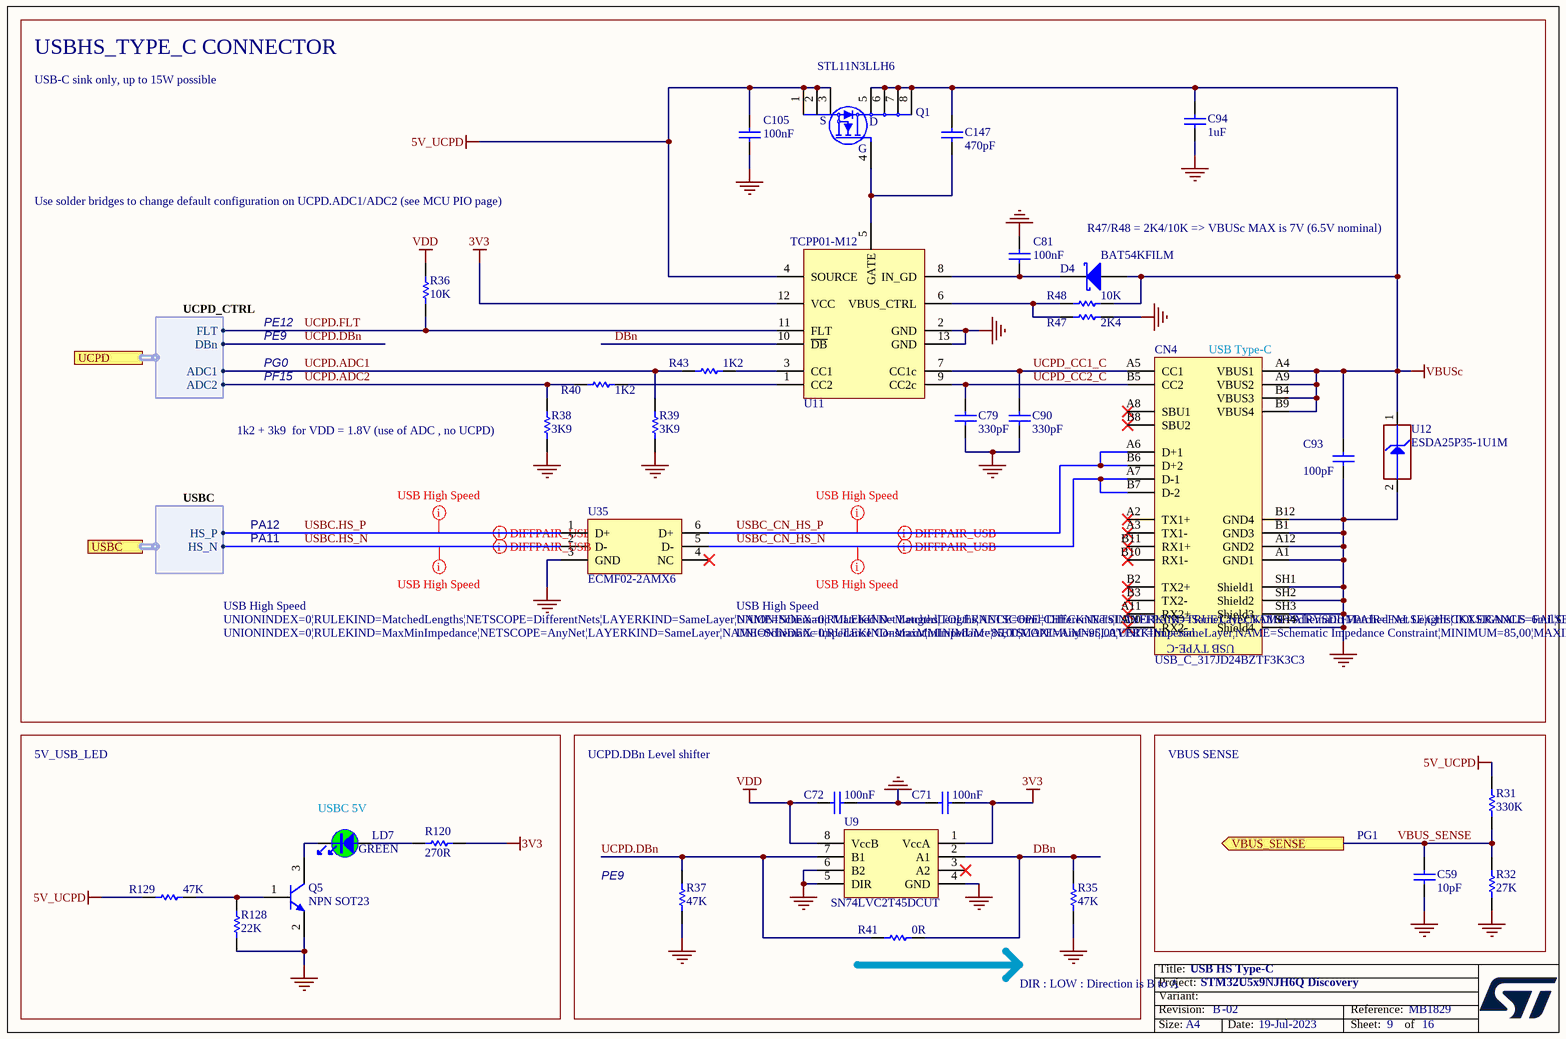
[diagram p11: USBHS_TYPEC.SchDoc]

### Parts
C59  value 10pF  [C0603]  (hidden comment: Capacitor)
C71  value 100nF  [C0402]  (hidden comment: Capacitor)
C72  value 100nF  [C0402]  (hidden comment: Capacitor)
C79  value 330pF  [C0402]  (hidden comment: Capacitor)
C81  value 100nF  [C0603]  (hidden comment: Capacitor)
C90  value 330pF  [C0402]  (hidden comment: Capacitor)
C93  value 100pF  [C0402]  (hidden comment: Capacitor)
C94  value 1uF  [C0402]  (hidden comment: Capacitor)
C105  value 100nF  [C0603]  (hidden comment: Capacitor)
C147  value 470pF  [C0402]  (hidden comment: Capacitor)
CN4  value USB_C_317JD24BZTF3K3C3  [CON_USB-TYPEC_COXOC_317JD24BZTF3K3C3]  (hidden comment: USB_TYPE_C_Receptacle_317JD24BZTF3K3C3)
D4  value BAT54KFILM  [DIO_SOD523_1A_2K]  (hidden comment: SCHOTTKY_1A_2K)
LD7  value GREEN  [LED_0603_OSRAM_LG-Q396-PS-35_GREEN_1A2K_H0P4]  (hidden comment: LED_green)
Q1  STL11N3LLH6  [MOS_POWERFLAT_3P3X3P3_P065]
Q5  value NPN SOT23  [NPN_SOT23]  (hidden comment: 9013-SOT23)
R31  value 330K  [R0603]  (hidden comment: Resistor)
R32  value 27K  [R0603]  (hidden comment: Resistor)
R35  value 47K  [R0603]  (hidden comment: Resistor)
R36  value 10K  [R0603]  (hidden comment: Resistor)
R37  value 47K  [R0603]  (hidden comment: Resistor)
R38  value 3K9  [R0402]  (hidden comment: Resistor)
R39  value 3K9  [R0402]  (hidden comment: Resistor)
R40  value 1K2  [R0402]  (hidden comment: Resistor)
R41  value 0R  [R0402]  (hidden comment: Resistor)
R43  value 1K2  [R0402]  (hidden comment: Resistor)
R47  value 2K4  [R0402]  (hidden comment: Resistor)
R48  value 10K  [R0402]  (hidden comment: Resistor)
R120  value 270R  [R0402]  (hidden comment: Resistor)
R128  value 22K  [R0603]  (hidden comment: Resistor)
R129  value 47K  [R0603]  (hidden comment: Resistor)
U9  SN74LVC2T45DCUT  [ICC_VSSOP8_DCU_R-PDSO-G8_2X2P30_P050]
U11  TCPP01-M12  [ICC_QFN12L-EPAD_3X3_P050]
U12  value ESDA25P35-1U1M  [ESD_QFN1610_2N_1K_2A]  (hidden comment: ESD-TRANSIL)
U35  ECMF02-2AMX6  [ESD_QFN-6L_1P7X1P5_P050]

### Blocks framed on the sheet
USBHS_TYPE_C CONNECTOR: C79 C81 C90 C93 C94 C105 C147 CN4 D4 Q1 R36 R38-R40 R43 R47 R48 U11 U12 U35

### Ports
UCPD (harness UCPD_CTRL), USBC (harness USBC), VBUS_SENSE (out)

### Harnesses
USBC: HS_P, HS_N
UCPD_CTRL: FLT, DBn, ADC1, ADC2

### Nets
3V3: C71.2 R120.2 U9.1(VccA) U11.12(VCC)
5V_UCPD: C105.1 Q1.1(S) Q1.2(S) Q1.3(S) R31.2 R129.1 U11.4(SOURCE)
GND: C59.1 C71.1 C72.2 C79.1 C81.1 C90.1 C93.1 C94.1 C105.2 CN4.A1(GND1) CN4.A12(GND2) CN4.B1(GND3) CN4.B12(GND4) CN4.SH1(Shield1) CN4.SH2(Shield2) CN4.SH3(Shield3) CN4.SH4(Shield4) Q5.2(E) R32.1 R35.1 R37.2 R38.1 R39.1 R47.2 R128.1 U9.4(GND) U9.5(DIR) U9.6(B2) U11.2(GND) U11.13(GND) U12.2(GND) U35.3(GND)
VBUSc: C93.2 C94.2 C147.2 CN4.A4(VBUS1) CN4.A9(VBUS2) CN4.B4(VBUS3) CN4.B9(VBUS4) D4.1(A) Q1.5(D) Q1.6(D) Q1.7(D) Q1.8(D) R48.2 U12.1(IO1)
VDD: C72.1 R36.2 U9.8(VccB)
DBn: R35.2 R41.2 U9.2(A1) U11.10(~{DB})
UCPD.ADC1: R39.2 R43.1 ; port UCPD.ADC1
UCPD.ADC2: R38.2 R40.1 ; port UCPD.ADC2
UCPD.DBn: R37.1 R41.1 U9.7(B1) ; port UCPD.DBn
UCPD.FLT: R36.1 U11.11(FLT) ; port UCPD.FLT
UCPD_CC1_C: C90.2 CN4.A5(CC1) U11.7(CC1c)
UCPD_CC2_C: C79.2 CN4.B5(CC2) U11.9(CC2c)
USBC.HS_N: U35.2(D-) ; port USBC.HS_N
USBC.HS_P: U35.1(D+) ; port USBC.HS_P
USBC_CN_HS_N: CN4.A7(D-1) CN4.B7(D-2) U35.5(D-)
USBC_CN_HS_P: CN4.A6(D+1) CN4.B6(D+2) U35.6(D+)
VBUS_SENSE: C59.2 R31.1 R32.2 ; port VBUS_SENSE
NetC81_2: C81.2 D4.2(K) U11.8(IN_GD)
NetC147_1: C147.1 Q1.4(G) U11.5(GATE)
NetLD7_1: LD7.1 R120.1
NetLD7_2: LD7.2 Q5.3(C)
NetQ5_1: Q5.1(B) R128.2 R129.2
NetR40_2: R40.2 U11.1(CC2)
NetR43_2: R43.2 U11.3(CC1)
NetR47_1: R47.1 R48.1 U11.6(VBUS_CTRL)

Not connected (* = marked no-connect by the designer): CN4 A2(TX1+)* A3(TX1-)* A8(SBU1)* A10(RX2-)* A11(RX2+)* B2(TX2+)* B3(TX2-)* B8(SBU2)* B10(RX1-)* B11(RX1+)*; U9 3(A2)*; U35 4(NC)*

### Layout directives
differential pair; rule Impedance Constraint [Min = 85.00    Max = 95.00    ]: USBC.HS_N, USBC.HS_P, USBC_CN_HS_N, USBC_CN_HS_P
rule Matched Net Lengths [Tolerance = 6mil]; rule Routing Layers [TopLayer - Enabled BottomLayer - Enabled ]; rule Impedance Constraint [Min = 85.00    Max = 95.00    ]; net class USB High Speed: USBC.HS_P, USBC_CN_HS_P
rule Matched Net Lengths [Tolerance = 0mil]; rule Routing Layers [TopLayer - Enabled BottomLayer - Enabled ]; rule Impedance Constraint [Min = 85.00    Max = 95.00    ]; net class USB High Speed: USBC.HS_N, USBC_CN_HS_N

### Notes on the sheet
- USB-C sink only, up to 15W possible
- Use solder bridges to change default configuration on UCPD.ADC1/ADC2 (see MCU PIO page)
- (near D4) R47/R48 = 2K4/10K => VBUSc MAX is 7V (6.5V nominal)
- PG0
- PF15
- PE12
- PE9
- (near CN4) USB Type-C
- (near R38) 1k2 + 3k9  for VDD = 1.8V (use of ADC , no UCPD)
- PA12
- PA11
- 5V_USB_LED
- UCPD.DBn Level shifter
- VBUS SENSE
- (near LD7) USBC 5V
- PG1
- (near R41) DIR : LOW : Direction is B to A
- Title:
- Project:
- Size:
- Revision:
- Variant:
- A4
- -
- Date:
- Reference:
- Sheet:
- of
- (in symbol MCD-01108) USB TYPE-C

### Library data of the parts
C59 = MCD-00637: Capacitor, MLCC, 10pF, 50V, NPO, +/-5%, 0603, T=0.8mm; Manufacturer_Part_Number: CC0603JRNPO9BN100; Manufacturer: YAGEO; Part_Preference: Recommended; Order_Code_RS: 616-9054; Component_Country_Of_Origin: China; Internal_Part_Number: MCD-00637; Status: Released; Part_Type: Capacitor; Package: 0603; ComponentLink1URL: http://tunmcdsvn.tun.st.com/Component_Documentation_Library/Trunk/Capacitor/YAGEO_NP0_Series; Order_Code_Digikey: 311-1058-1-ND; Order_Code_Farnell: 721967
C71 C72 = MCD-00006: Capacitor, MLCC, 100nF, 16V, X7R, +/-10%, 0402, T=0.5mm; Manufacturer_Part_Number: CC0402KRX7R7BB104; Manufacturer: YAGEO; Part_Preference: Recommended; Order_Code_RS: 616-9701; Component_Country_Of_Origin: China; Internal_Part_Number: MCD-00006; Status: Released; Part_Type: Capacitor; Package: 0402; ComponentLink1URL: http://tunmcdsvn.tun.st.com/Component_Documentation_Library/Trunk/Capacitor/YAGEO_X7R_Series; Order_Code_Digikey: 311-1338-1-ND; Order_Code_Farnell: 9402047
C79 C90 = MCD-01579: Capacitor, MLCC, 330pF, 50V, NPO, +/-5%, 0402, T=0.5mm; Manufacturer: YAGEO; Manufacturer_Part_Number: CC0402JRNPO9BN331; Part_Preference: Recommended; Component_Country_Of_Origin: China; Internal_Part_Number: MCD-01579; Status: Checked; Part_Type: Capacitor; Package: 0402; ComponentLink1URL: http://tunmcdsvn.tun.st.com/Component_Documentation_Library/Trunk/Capacitor/YAGEO_NP0_Series; Order_Code_Digikey: 311-1667-1-ND; Order_Code_Farnell: N/A; Order_Code_RS: N/A
C81 C105 = MCD-01099: Capacitor, MLCC, 100nF, 50V, X7R, +/-10%, 0603, T=0.8mm; Manufacturer_Part_Number: CC0603KRX7R9BB104; Manufacturer: YAGEO; BMS_Part_Number: 9142278; Part_Preference: Recommended; Order_Code_RS: 669-8767; Component_Country_Of_Origin: China; Internal_Part_Number: MCD-01099; Status: Released; Part_Type: Capacitor; Package: 0603; ComponentLink1URL: http://tunmcdsvn.tun.st.com/Component_Documentation_Library/Trunk/Capacitor/YAGEO_X7R_Series; Order_Code_Digikey: 311-1344-1-ND; Order_Code_Farnell: 1362556
C93 = MCD-00205: Capacitor, MLCC, 100pF, 50V, NPO, +/-5%, 0402, T=0.5mm; Part_Preference: Recommended; Manufacturer: YAGEO; Manufacturer_Part_Number: CC0402JRNPO9BN101; Component_Country_Of_Origin: China; Internal_Part_Number: MCD-00205; Status: Released; Part_Type: Capacitor; Package: 0402; ComponentLink1URL: http://tunmcdsvn.tun.st.com/Component_Documentation_Library/Trunk/Capacitor/YAGEO_NP0_Series; Order_Code_Digikey: 311-1024-1-ND; Order_Code_Farnell: 3019226RL; Order_Code_RS: N/A
C94 = MCD-02609: Capacitor, MLCC, 1uF, 25V, X5R, +/-10%, 0402, T=0.5mm; Part_Preference: Recommended; Manufacturer: YAGEO; Manufacturer_Part_Number: CC0402KRX5R8BB105; Internal_Part_Number: MCD-02609; Status: New; Part_Type: Capacitor; Package: 0402; ComponentLink1URL: http://tunmcdsvn.tun.st.com/Component_Documentation_Library/Trunk/Capacitor/YAGEO_X5R_Series; Order_Code_Digikey: 311-1698-2-ND; Order_Code_Farnell: 3366440; Order_Code_RS: N/A
C147 = MCD-00724: Capacitor, MLCC, 470pF, 50V, NPO, +/-5%, 0402, T=0.5mm; Part_Preference: Recommended; Manufacturer: YAGEO; Manufacturer_Part_Number: CC0402JRNPO9BN471; Order_Code_RS: 199-2186; Component_Country_Of_Origin: China; Internal_Part_Number: MCD-00724; Status: Released; Part_Type: Capacitor; Package: 0402; ComponentLink1URL: http://tunmcdsvn.tun.st.com/Component_Documentation_Library/Trunk/Capacitor/YAGEO_NP0_Series; Order_Code_Digikey: 311-1671-1-ND; Order_Code_Farnell: 3366416
CN4 = MCD-01108: USB_TypeC, SMD+DIP, T= 2.96mm (for 1.6mm pcb); Part_Type: Connector; Manufacturer: CHANT SINCERE (COXOC); Part_Preference: Recommended; Component_Country_Of_Origin: Unknown; Internal_Part_Number: MCD-01108; Status: Released; Manufacturer_Part_Number: 317JD24BZTF3K3C3; ComponentLink1URL: http://tunmcdsvn.tun.st.com/Component_Documentation_Library/Trunk/Connector/CHANT_SINCERE_(COXOC)_317JD24BZTF3K3C3/; Order_Code_Digikey: N/A; Order_Code_Farnell: N/A; Order_Code_RS: N/A
D4 = MCD-01677: Small signal Schottky diodes; Part_Type: Diode; Manufacturer: STMICROELECTRONICS; BMS_Part_Number: 9151123; Part_Preference: Recommended; Manufacturer_HQ_COO: EU; Component_Country_Of_Origin: China; Internal_Part_Number: MCD-01677; Status: Checked; Manufacturer_Part_Number: BAT54KFILM; Package: SOD-523; ComponentLink1URL: http://tunmcdsvn.tun.st.com/Component_Datasheet_Library/Trunk/Diodes/STM_SCHOTTKY_DOUBLE_BAT54SWFILM/STM_SCHOTTKY_DOUBLE_BAT54SWFILM.pdf
LD7 = MCD-00588: LED Green, 0603 SMD, Forward Voltage Typ=2V, Max=2.5V; Part_Type: Display; Manufacturer_Part_Number: LG Q396-PS-35; Manufacturer: OSRAM OPTO SEMICONDUCTORS; Part_Preference: Recommended; Alternate_Internal_Part_Number: MCD-02400; Component_Country_Of_Origin: Unknown; ShowFields: YES; ID: 3155; Internal_Part_Number: MCD-00588; Status: Released; Package: LED 0603; ComponentLink1URL: http://tunmcdsvn.tun.st.com/Component_Datasheet_Library/Trunk/Display/OSRAM_LED_GREEN_LG Q396-PS-35; Order_Code_Digikey: LG Q396-PS-35-ND
Q1 = MCD-01810: N-channel 30 V, 6 mΩ typ, 11 A STripFET™ H6, Power MOSFET in a PowerFLAT™ 3.3x3.3 package; BMS_Part_Number: 9153561; Part_Type: IC; Part_Preference: Recommended; Manufacturer: STMICROELECTRONICS; Manufacturer_HQ_COO: EU; Component_Country_Of_Origin: China; Internal_Part_Number: MCD-01810; Value: STL11N3LLH6; Status: Released; Manufacturer_Part_Number: STL11N3LLH6; Package: PowerFLAT 3.3x3.3; ComponentLink1URL: http://tunmcdsvn.tun.st.com/Component_Datasheet_Library/Trunk/IC/STM_POWER_MOSFET_STL11N3LLH6
Q5 = MCD-00073: NPN Bipolar Transistor; Part_Type: IC; Manufacturer_Part_Number: BSR14; Manufacturer: ON SEMICONDUCTOR; Part_Preference: Recommended; Component_Country_Of_Origin: Unknown; Revision: *; Internal_Part_Number: MCD-00073; Status: Released; ComponentLink1URL: http://tunmcdsvn.tun.st.com/Component_Datasheet_Library/Trunk/IC/NXP_Transistor_BSR14; Package: SOT23
R31 = MCD-00458: Resistor, 330K, 0603, +/-1%, 1/10W; Manufacturer_Part_Number: RC0603FR-07330KL; Manufacturer: YAGEO; Part_Preference: Recommended; Component_Country_Of_Origin: China; Internal_Part_Number: MCD-00458; Status: Released; Part_Type: Resistor; Package: 0603; ComponentLink1URL: http://tunmcdsvn.tun.st.com/Component_Documentation_Library/Trunk/Resistor/YAGEO_RC_L_Series; Order_Code_Digikey: 311-330KHRCT-ND; Order_Code_Farnell: 9238786; Order_Code_RS: N/A
R32 = MCD-00444: Resistor, 27K, 0603, +/-1%, 1/10W; Manufacturer_Part_Number: RC0603FR-0727KL; Manufacturer: YAGEO; Part_Preference: Recommended; Component_Country_Of_Origin: China; Internal_Part_Number: MCD-00444; Status: Released; Part_Type: Resistor; Package: 0603; ComponentLink1URL: http://tunmcdsvn.tun.st.com/Component_Documentation_Library/Trunk/Resistor/YAGEO_RC_L_Series; Order_Code_Digikey: 311-27.0KHRCT-ND; Order_Code_Farnell: 9238654; Order_Code_RS: N/A
R35 = MCD-00222: Resistor, 47K, 0603, 1%, 1/10W; Part_Preference: Recommended; Manufacturer: YAGEO; Manufacturer_Part_Number: RC0603FR-0747KL; Component_Country_Of_Origin: China; Internal_Part_Number: MCD-00222; Status: Released; Part_Type: Resistor; Package: 0603; ComponentLink1URL: http://tunmcdsvn.tun.st.com/Component_Documentation_Library/Trunk/Resistor/YAGEO_RC_L_Series; Order_Code_Digikey: 311-47.0KHRCT-ND; Order_Code_Farnell: 9238689; Order_Code_RS: N/A
R36 = MCD-00220: Resistor, 10K, 0603, +/-1%, 1/10W; Manufacturer_Part_Number: RC0603FR-0710KL; Manufacturer: YAGEO; Part_Preference: Recommended; Component_Country_Of_Origin: China; Internal_Part_Number: MCD-00220; Status: Released; Part_Type: Resistor; Package: 0603; ComponentLink1URL: http://tunmcdsvn.tun.st.com/Component_Documentation_Library/Trunk/Resistor/YAGEO_RC_L_Series; Order_Code_Digikey: 311-10.0KHRCT-ND; Order_Code_Farnell: 9238603; Order_Code_RS: N/A
R37 R129 = MCD-00222: Resistor, 47K, 0603, 1%, 1/10W; Manufacturer_Part_Number: RC0603FR-0747KL; Manufacturer: YAGEO; Part_Preference: Recommended; Component_Country_Of_Origin: China; Internal_Part_Number: MCD-00222; Status: Released; Part_Type: Resistor; Package: 0603; ComponentLink1URL: http://tunmcdsvn.tun.st.com/Component_Documentation_Library/Trunk/Resistor/YAGEO_RC_L_Series; Order_Code_Digikey: 311-47.0KHRCT-ND; Order_Code_Farnell: 9238689; Order_Code_RS: N/A
R38 R39 = MCD-02455: Resistor, 3K9, 0402, +/-1%, 1/16W, +/-100ppm/°C; Part_Preference: Recommended; Manufacturer: YAGEO; Manufacturer_Part_Number: RC0402FR-073K9L; Order_Code_RS: 198-7783; Component_Country_Of_Origin: China; Internal_Part_Number: MCD-02455; Status: Checked; Part_Type: Resistor; Package: 0402; ComponentLink1URL: http://tunmcdsvn.tun.st.com/Component_Documentation_Library/Trunk/Resistor/YAGEO_RC0402_Series/; Order_Code_Digikey: 311-3.90KLRTR-ND; Order_Code_Farnell: 9239308
R40 R43 = MCD-00373: Resistor, 1K2, 0402, +/-1%, 1/16W; Part_Preference: Recommended; Manufacturer: YAGEO; Manufacturer_Part_Number: RC0402FR-071K2L; Component_Country_Of_Origin: China; Internal_Part_Number: MCD-00373; Status: Released; Part_Type: Resistor; Package: 0402; ComponentLink1URL: http://tunmcdsvn.tun.st.com/Component_Documentation_Library/Trunk/Resistor/YAGEO_RC_L_Series; Order_Code_Digikey: 311-1.20KLRCT-ND; Order_Code_Farnell: 9239243; Order_Code_RS: N/A
R41 = MCD-00052: Resistor, 0R, 0402, +/-5%, 1/16W; Manufacturer_Part_Number: RC0402JR-070RL; Manufacturer: YAGEO; Part_Preference: Recommended; Order_Code_RS: 618-5804; Component_Country_Of_Origin: China; Internal_Part_Number: MCD-00052; Status: Released; Part_Type: Resistor; Package: 0402; ComponentLink1URL: http://tunmcdsvn.tun.st.com/Component_Documentation_Library/Trunk/Resistor/YAGEO_RC_L_Series; Order_Code_Digikey: 311-0.0JRCT-ND; Order_Code_Farnell: 9232516RL
R47 = MCD-00433: Resistor, 2K4, 0402, +/-1%, 1/16W; Part_Preference: Recommended; Manufacturer: YAGEO; Manufacturer_Part_Number: RC0402FR-072K4L; Component_Country_Of_Origin: China; Internal_Part_Number: MCD-00433; Status: Released; Part_Type: Resistor; Package: 0402; ComponentLink1URL: http://tunmcdsvn.tun.st.com/Component_Documentation_Library/Trunk/Resistor/YAGEO_RC_L_Series; Order_Code_Digikey: 311-2.40KLRCT-ND; Order_Code_Farnell: 1458767; Order_Code_RS: N/A
R48 = MCD-00053: Resistor, 10K, 0402, +/-1%, 1/16W; BMS_Part_Number: 9131590; Part_Preference: Recommended; Manufacturer: YAGEO; Manufacturer_Part_Number: RC0402FR-0710KL; Component_Country_Of_Origin: China; Internal_Part_Number: MCD-00053; Status: Released; Part_Type: Resistor; Package: 0402; ComponentLink1URL: http://tunmcdsvn.tun.st.com/Component_Documentation_Library/Trunk/Resistor/YAGEO_RC_L_Series; Order_Code_Digikey: 311-10.0KLRCT-ND; Order_Code_Farnell: 9239359; Order_Code_RS: N/A
R120 = MCD-00441: Resistor, 270R, 0402, +/-1%, 1/16W; Manufacturer: YAGEO; Manufacturer_Part_Number: RC0402FR-07270RL; Part_Preference: Recommended; Component_Country_Of_Origin: China; ShowFields: YES; ID: 2838; Internal_Part_Number: MCD-00441; Status: Released; Part_Type: Resistor; Package: 0402; ComponentLink1URL: http://tunmcdsvn.tun.st.com/Component_Documentation_Library/Trunk/Resistor/YAGEO_RC_L_Series; Order_Code_Digikey: 311-270LRCT-ND; Order_Code_Farnell: 9239162; Order_Code_RS: N/A
R128 = MCD-00430: Resistor, 22K, 0603, +/-1%, 1/10W; Manufacturer_Part_Number: RC0603FR-0722KL; Manufacturer: YAGEO; Part_Preference: Recommended; Component_Country_Of_Origin: China; Internal_Part_Number: MCD-00430; Status: Released; Part_Type: Resistor; Package: 0603; ComponentLink1URL: http://tunmcdsvn.tun.st.com/Component_Documentation_Library/Trunk/Resistor/YAGEO_RC_L_Series; Order_Code_Digikey: 311-22.0KHRCT-ND; Order_Code_Farnell: 9238646; Order_Code_RS: N/A
U9 = MCD-00264: Dual bit dual supply bus transceiver; Part_Type: IC; Manufacturer: TEXAS INSTRUMENTS; BMS_Part_Number: 9169311; Part_Preference: Recommended; Component_Country_Of_Origin: Thailand; Internal_Part_Number: MCD-00264; Value: SN74LVC2T45DCUT; Status: Released; Manufacturer_Part_Number: SN74LVC2T45DCUT; ComponentLink1URL: http://tunmcdsvn.tun.st.com/Component_Datasheet_Library/Trunk/IC/TI_Dual_bit_tranceiver_SN74LVC2T45
U11 = MCD-01809: USB Type-C Port Protection for USB Power Delivery, PPS compliant; Part_Type: IC; Manufacturer: STMICROELECTRONICS; BMS_Part_Number: 9151145; Part_Preference: Recommended; Manufacturer_HQ_COO: EU; Component_Country_Of_Origin: Malaysia; Internal_Part_Number: MCD-01809; Value: TCPP01-M12; Status: Released; Manufacturer_Part_Number: TCPP01-M12; Package: QFN-12L; ComponentLink1URL: http://tunmcdsvn.tun.st.com/Component_Datasheet_Library/Trunk/IC/STM_UCPD_Protection_TCPP01-M12
U12 = MCD-01207: High power Transient voltage suppressor:25V/35A EOS and ESD transients protection.; Part_Type: Diode; Manufacturer: STMICROELECTRONICS; BMS_Part_Number: 9179045; Part_Preference: Recommended; Manufacturer_HQ_COO: EU; Component_Country_Of_Origin: China; Internal_Part_Number: MCD-01207; Status: Released; Manufacturer_Part_Number: ESDA25P35-1U1M; Package: QFN1610; ComponentLink1URL: http://tunmcdsvn.tun.st.com/Component_Datasheet_Library/Trunk/Diodes/STM_ESD_ESDA25P35-1U1M
U35 = MCD-00649: Common mode filter with ESD protection for USB 2.0 interface; Part_Type: Diode; Manufacturer: STMICROELECTRONICS; BMS_Part_Number: 9151138; Part_Preference: Recommended; Manufacturer_HQ_COO: EU; Component_Country_Of_Origin: China; Internal_Part_Number: MCD-00649; Value: ECMF02-2AMX6; Status: Released; Manufacturer_Part_Number: ECMF02-2AMX6; ComponentLink1URL: http://tunmcdsvn.tun.st.com/Component_Datasheet_Library/Trunk/Diodes/STM_ESD_ECMF02-2AMX6